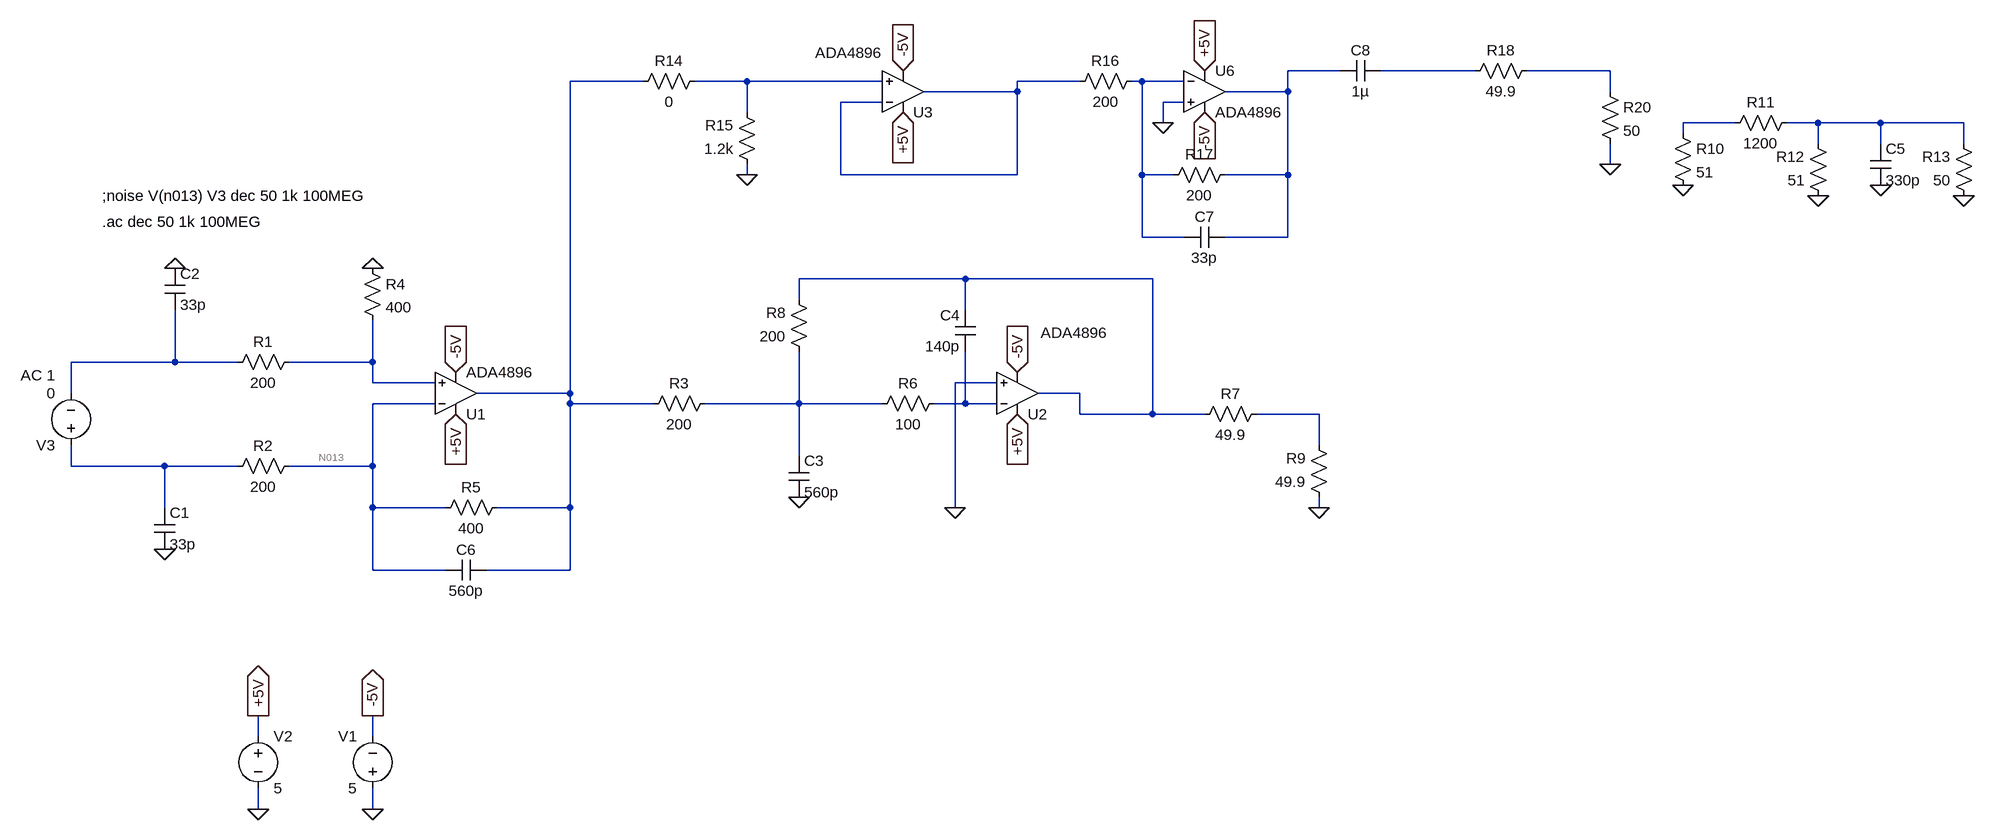
[diagram p0: schematic Rev1.1.asc]
Rev1.1.asc, the LTspice schematic file:
Version 4
SHEET 1 2532 824
WIRE 1552 -352 1472 -352
WIRE 1760 -352 1616 -352
WIRE 1968 -352 1840 -352
WIRE 480 -336 368 -336
WIRE 640 -336 560 -336
WIRE 848 -336 640 -336
WIRE 1152 -336 1056 -336
WIRE 1248 -336 1232 -336
WIRE 1312 -336 1248 -336
WIRE 1056 -320 1056 -336
WIRE 1056 -320 912 -320
WIRE 1472 -320 1472 -352
WIRE 1472 -320 1376 -320
WIRE 1968 -320 1968 -352
WIRE 848 -304 784 -304
WIRE 1312 -304 1280 -304
WIRE 640 -288 640 -336
WIRE 1280 -272 1280 -304
WIRE 2160 -272 2080 -272
WIRE 2288 -272 2240 -272
WIRE 2384 -272 2288 -272
WIRE 2512 -272 2384 -272
WIRE 2080 -256 2080 -272
WIRE 2288 -240 2288 -272
WIRE 2384 -240 2384 -272
WIRE 2512 -240 2512 -272
WIRE 1968 -208 1968 -240
WIRE 640 -192 640 -208
WIRE 784 -192 784 -304
WIRE 1056 -192 1056 -320
WIRE 1056 -192 784 -192
WIRE 1248 -192 1248 -336
WIRE 1296 -192 1248 -192
WIRE 1472 -192 1472 -320
WIRE 1472 -192 1376 -192
WIRE 1248 -96 1248 -192
WIRE 1312 -96 1248 -96
WIRE 1472 -96 1472 -192
WIRE 1472 -96 1376 -96
WIRE 976 -32 720 -32
WIRE 1264 -32 976 -32
WIRE 720 0 720 -32
WIRE 976 16 976 -32
WIRE -240 96 -240 16
WIRE -240 96 -400 96
WIRE -144 96 -240 96
WIRE 64 96 64 32
WIRE 64 96 -64 96
WIRE 64 128 64 96
WIRE 160 128 64 128
WIRE 1024 128 960 128
WIRE -400 144 -400 96
WIRE 368 144 368 -336
WIRE 368 144 224 144
WIRE 1152 144 1088 144
WIRE 160 160 64 160
WIRE 368 160 368 144
WIRE 496 160 368 160
WIRE 720 160 720 80
WIRE 720 160 576 160
WIRE 848 160 720 160
WIRE 976 160 976 80
WIRE 976 160 928 160
WIRE 1024 160 976 160
WIRE 1152 176 1152 144
WIRE 1264 176 1264 -32
WIRE 1264 176 1152 176
WIRE 1344 176 1264 176
WIRE 1520 176 1424 176
WIRE 1520 224 1520 176
WIRE 720 240 720 160
WIRE -400 256 -400 224
WIRE -256 256 -400 256
WIRE -144 256 -256 256
WIRE 64 256 64 160
WIRE 64 256 -64 256
WIRE -256 320 -256 256
WIRE 64 320 64 256
WIRE 176 320 64 320
WIRE 368 320 368 160
WIRE 368 320 256 320
WIRE 960 320 960 128
WIRE 1520 320 1520 304
WIRE 64 416 64 320
WIRE 176 416 64 416
WIRE 368 416 368 320
WIRE 368 416 240 416
WIRE -112 672 -112 640
WIRE 64 672 64 640
WIRE -112 784 -112 752
WIRE 64 784 64 752
FLAG -112 784 0
FLAG 64 784 0
FLAG 64 -48 0
FLAG -256 384 0
FLAG -240 -48 0
FLAG -112 640 +5V
IOPIN -112 640 Out
FLAG 64 640 -5V
IOPIN 64 640 Out
FLAG 192 176 +5V
IOPIN 192 176 In
FLAG 1056 176 +5V
IOPIN 1056 176 In
FLAG 192 112 -5V
IOPIN 192 112 In
FLAG 1056 112 -5V
IOPIN 1056 112 In
FLAG 720 304 0
FLAG 960 320 0
FLAG 1520 320 0
FLAG 2080 -176 0
FLAG 2288 -160 0
FLAG 2384 -176 0
FLAG 2512 -160 0
FLAG 640 -192 0
FLAG 1344 -288 -5V
IOPIN 1344 -288 In
FLAG 1344 -352 +5V
IOPIN 1344 -352 In
FLAG 880 -288 +5V
IOPIN 880 -288 In
FLAG 880 -352 -5V
IOPIN 880 -352 In
FLAG 1968 -208 0
FLAG 1280 -272 0
SYMBOL voltage 64 768 R180
WINDOW 0 24 96 Left 2
WINDOW 3 24 16 Left 2
WINDOW 123 0 0 Left 0
WINDOW 39 0 0 Left 0
SYMATTR InstName V1
SYMATTR Value 5
SYMBOL voltage -112 656 R0
WINDOW 123 0 0 Left 0
WINDOW 39 0 0 Left 0
SYMATTR InstName V2
SYMATTR Value 5
SYMBOL voltage -400 240 R180
WINDOW 123 24 124 Left 2
WINDOW 39 0 0 Left 0
SYMATTR Value2 AC 1
SYMATTR InstName V3
SYMATTR Value 0
SYMBOL res -48 80 R90
WINDOW 0 0 56 VBottom 2
WINDOW 3 32 56 VTop 2
SYMATTR InstName R1
SYMATTR Value 200
SYMBOL res -48 240 R90
WINDOW 0 0 56 VBottom 2
WINDOW 3 32 56 VTop 2
SYMATTR InstName R2
SYMATTR Value 200
SYMBOL res 592 144 R90
WINDOW 0 0 56 VBottom 2
WINDOW 3 32 56 VTop 2
SYMATTR InstName R3
SYMATTR Value 200
SYMBOL res 48 -64 R0
SYMATTR InstName R4
SYMATTR Value 400
SYMBOL res 160 336 R270
WINDOW 0 32 56 VTop 2
WINDOW 3 0 56 VBottom 2
SYMATTR InstName R5
SYMATTR Value 400
SYMBOL cap -272 320 R0
SYMATTR InstName C1
SYMATTR Value 33p
SYMBOL cap -256 -48 R0
SYMATTR InstName C2
SYMATTR Value 33p
SYMBOL cap 704 240 R0
SYMATTR InstName C3
SYMATTR Value 560p
SYMBOL cap 992 80 R180
WINDOW 0 24 56 Left 2
WINDOW 3 24 8 Left 2
SYMATTR InstName C4
SYMATTR Value 140p
SYMBOL res 944 144 R90
WINDOW 0 0 56 VBottom 2
WINDOW 3 32 56 VTop 2
SYMATTR InstName R6
SYMATTR Value 100
SYMBOL res 736 96 R180
WINDOW 0 36 76 Left 2
WINDOW 3 36 40 Left 2
SYMATTR InstName R8
SYMATTR Value 200
SYMBOL res 1440 160 R90
WINDOW 0 0 56 VBottom 2
WINDOW 3 32 56 VTop 2
SYMATTR InstName R7
SYMATTR Value 49.9
SYMBOL res 1536 320 R180
WINDOW 0 36 76 Left 2
WINDOW 3 36 40 Left 2
SYMATTR InstName R9
SYMATTR Value 49.9
SYMBOL res 2064 -272 R0
SYMATTR InstName R10
SYMATTR Value 51
SYMBOL res 2256 -288 R90
WINDOW 0 0 56 VBottom 2
WINDOW 3 32 56 VTop 2
SYMATTR InstName R11
SYMATTR Value 1200
SYMBOL res 2304 -144 R180
WINDOW 0 36 76 Left 2
WINDOW 3 36 40 Left 2
SYMATTR InstName R12
SYMATTR Value 51
SYMBOL res 2528 -144 R180
WINDOW 0 36 76 Left 2
WINDOW 3 36 40 Left 2
SYMATTR InstName R13
SYMATTR Value 50
SYMBOL cap 2368 -240 R0
SYMATTR InstName C5
SYMATTR Value 330p
SYMBOL res 576 -352 R90
WINDOW 0 0 56 VBottom 2
WINDOW 3 32 56 VTop 2
SYMATTR InstName R14
SYMATTR Value 0
SYMBOL res 656 -192 R180
WINDOW 0 36 76 Left 2
WINDOW 3 36 40 Left 2
SYMATTR InstName R15
SYMATTR Value 1.2k
SYMBOL res 1392 -208 R90
WINDOW 0 0 56 VBottom 2
WINDOW 3 32 56 VTop 2
SYMATTR InstName R17
SYMATTR Value 200
SYMBOL ADA4896 192 208 M180
SYMATTR InstName U1
SYMBOL ADA4896 1056 208 M180
WINDOW 3 36 157 Left 2
SYMATTR InstName U2
SYMBOL ADA4896 1344 -384 R0
SYMATTR InstName U6
SYMBOL cap 240 400 R90
WINDOW 0 0 32 VBottom 2
WINDOW 3 32 32 VTop 2
SYMATTR InstName C6
SYMATTR Value 560p
SYMBOL ADA4896 880 -256 M180
WINDOW 3 -135 124 Left 2
SYMATTR InstName U3
SYMBOL cap 1376 -112 R90
WINDOW 0 0 32 VBottom 2
WINDOW 3 32 32 VTop 2
SYMATTR InstName C7
SYMATTR Value 33p
SYMBOL res 1248 -352 R90
WINDOW 0 0 56 VBottom 2
WINDOW 3 32 56 VTop 2
SYMATTR InstName R16
SYMATTR Value 200
SYMBOL cap 1616 -368 R90
WINDOW 0 0 32 VBottom 2
WINDOW 3 32 32 VTop 2
SYMATTR InstName C8
SYMATTR Value 1µ
SYMBOL res 1856 -368 R90
WINDOW 0 0 56 VBottom 2
WINDOW 3 32 56 VTop 2
SYMATTR InstName R18
SYMATTR Value 49.9
SYMBOL res 1952 -336 R0
SYMATTR InstName R20
SYMATTR Value 50
TEXT -352 -120 Left 2 !.ac dec 50 1k 100MEG
TEXT -352 -160 Left 2 !;noise V(n013) V3 dec 50 1k 100MEG

The netlist it stands for:
* Rev1.1.asc
V1 0 -5V 5
V2 +5V 0 5
V3 N017 N011 0 AC 1
R1 N012 N011 200
R2 N013 N017 200
R3 N014 N004 200
R4 0 N012 400
R5 N013 N004 400
C1 N017 0 33p
C2 0 N011 33p
C3 N014 0 560p
C4 N015 N010 140p
R6 N015 N014 100
R8 N014 N010 200
R7 N016 N010 49.9
R9 0 N016 49.9
R10 N008 0 51
R11 N009 N008 1200
R12 0 N009 51
R13 0 N009 50
C5 N009 0 330p
R14 N005 N004 0
R15 0 N005 1.2k
R17 N001 N007 200
* U1: ADA4896 (symbol ADA4896 not available, pins judged from their places): In+=N012 In-=N013 V+=+5V V-=-5V OUT=N004
* U2: ADA4896 (symbol ADA4896 not available, pins judged from their places): In+=0 In-=N015 V+=+5V V-=-5V OUT=N010
* U6: ADA4896 (symbol ADA4896 not available, pins judged from their places): In+=0 In-=N007 V+=+5V V-=-5V OUT=N001
C6 N004 N013 560p
* U3: ADA4896 (symbol ADA4896 not available, pins judged from their places): In+=N005 In-=N006 V+=+5V V-=-5V OUT=N006
C7 N001 N007 33p
R16 N007 N006 200
C8 N002 N001 1µ
R18 N003 N002 49.9
R20 N003 0 50
.ac dec 50 1k 100MEG
;noise V(n013) V3 dec 50 1k 100MEG
.backanno
.end